# Altium schematic sheet Debug.SchDoc
size A4; SheetNumber: 3; SheetTotal: 14
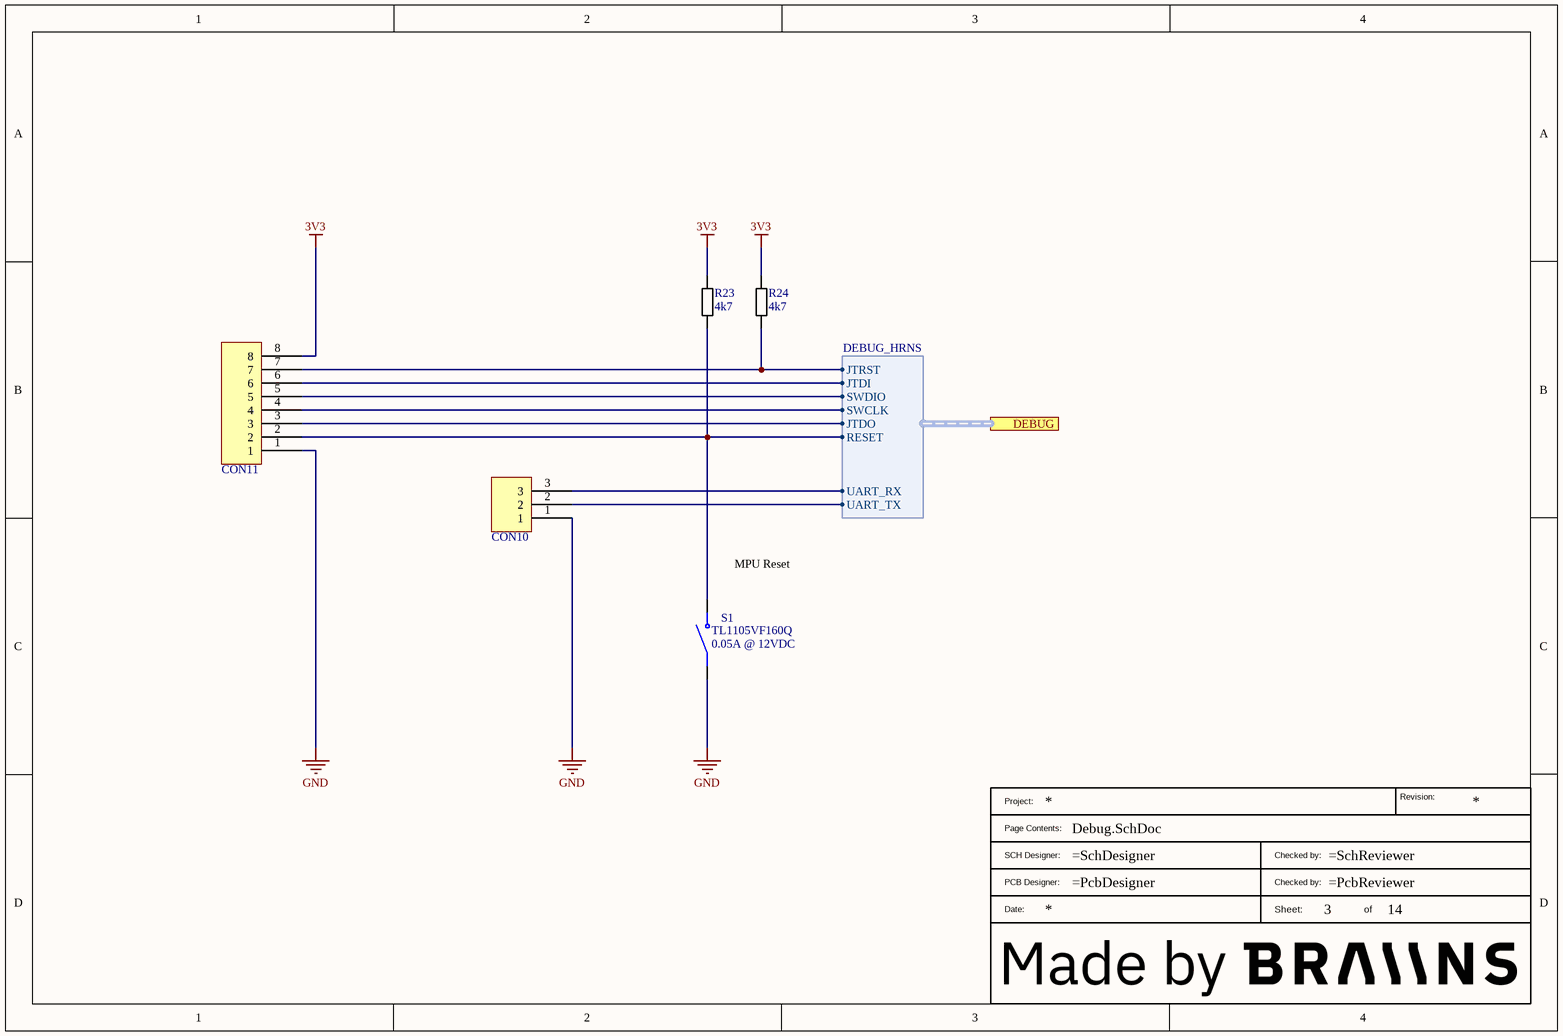
[diagram p0: Debug.SchDoc]

## Parts
?  BraiinsTitleBlockWithLogo  (value not drawn)  (graphical)
CON10  Connector 3pin  [PIN_HEADER_254_3]  (value not drawn)
CON11  Connector 8pin  [PIN_HEADER_254_2x4]  (value not drawn)
R23  4k7  [RES0402]
R24  4k7  [RES0402]
S1  Voltage_Rating: 0.05A @ 12VDC  [SW_TL1105VF160Q]  (hidden comment: TL1105VF160Q)

## Ports
DEBUG (harness DEBUG_HRNS)

## Harnesses
DEBUG_HRNS: JTDI, JTDO, JTRST, RESET, SWCLK, SWDIO, UART_RX, UART_TX

## Nets
3V3: CON11.8 R23.1 R24.1
GND: CON10.1 CON11.1 S1.1
NetCON10_2: CON10.2 ; port DEBUG.UART_TX
NetCON10_3: CON10.3 ; port DEBUG.UART_RX
NetCON11_2: CON11.2 R23.2 S1.2 ; port DEBUG.RESET
NetCON11_3: CON11.3 ; port DEBUG.JTDO
NetCON11_4: CON11.4 ; port DEBUG.SWCLK
NetCON11_5: CON11.5 ; port DEBUG.SWDIO
NetCON11_6: CON11.6 ; port DEBUG.JTDI
NetCON11_7: CON11.7 R24.2 ; port DEBUG.JTRST

## Notes on the sheet
- (near S1) MPU Reset
- (in symbol BraiinsTitleBlockWithLogo) Revision:; Project:; Page Contents:; SCH Designer:; Checked by:; PCB Designer:; Date:; Sheet:; of

## Library data of the parts
CON10 = 30103: Pin Header 1x3, 2.54mm; Part_Status: New; ID: 30103; Updated By: janjuranek; Part_Type: Connector; Manufacturer Part Description: Pin Header 1x3, 2.54mm; RoHS: Yes; Created By: janjuranek; Created_Date: 2023-03-14 02:43:17; Updated_Date: 2023-03-14 02:43:55; ComponentLink1Description: Datasheet; ComponentLink2Description: Supplier Part Details
CON11 = 30181: Pin Header 2x4 2.54mm; Part_Status: New; ID: 30181; Updated By: janjuranek; Part_Type: Connector; Manufacturer Part Description: Pin Header 2x4 2.54mm; Package_Case: THT; RoHS: Yes; Created By: janjuranek; Created_Date: 2023-05-15 18:44:13; Updated_Date: 2023-05-15 18:44:54; ComponentLink1Description: Datasheet; ComponentLink2Description: Supplier Part Details
R23 R24 = 30073: RES 4k7 Ohm 1% 0402; Part_Status: New; ID: 30073; Updated By: Jan; Sorted_Value: 4; Value: 4k7; Part_Type: Resistor; Manufacturer Part Description: RES 4k7 Ohm 1% 0402; Package_Case: 0402; RoHS: Yes; Tolerance: 1%; Created By: Jan; Created_Date: 2023-03-02 13:15:12; Updated_Date: 2023-03-02 13:15:46; ComponentLink1Description: Datasheet; ComponentLink2Description: Supplier Part Details; Temperature Range: -40 to +150C
S1 = 30149: SWITCH TACTILE SPST-NO 0.05A 12V; Manufacturer: E-Switch; Part_Status: New; ID: 30149; Updated By: janjuranek; Value: TL1105VF160Q; Part_Type: Switch; Manufacturer Part Number: TL1105VF160Q; Manufacturer Part Description: SWITCH TACTILE SPST-NO 0.05A 12V; Supplier 1: Digi-Key; Supplier Part Number 1: EG2508-ND; RoHS: Yes; Temperature Range: -20C to +70C; Created By: janjuranek; Created_Date: 2023-04-27 16:07:58; Updated_Date: 2023-04-27 17:09:30; ComponentLink1Description: Datasheet; ComponentLink2Description: Supplier Part Details; ComponentLink2URL: https://www.digikey.com/products/en?keywords=TL1105VF160Q